# Altium schematic sheet Solar.SchDoc: OS-Solar
size A3; CompanyName: Kaasa5; DrawnBy: Nathan Kuchel; Organization: Kaasa5; Revision: 1.0.0; SheetNumber: 2; SheetTotal: 3; SheetTitle: Solar
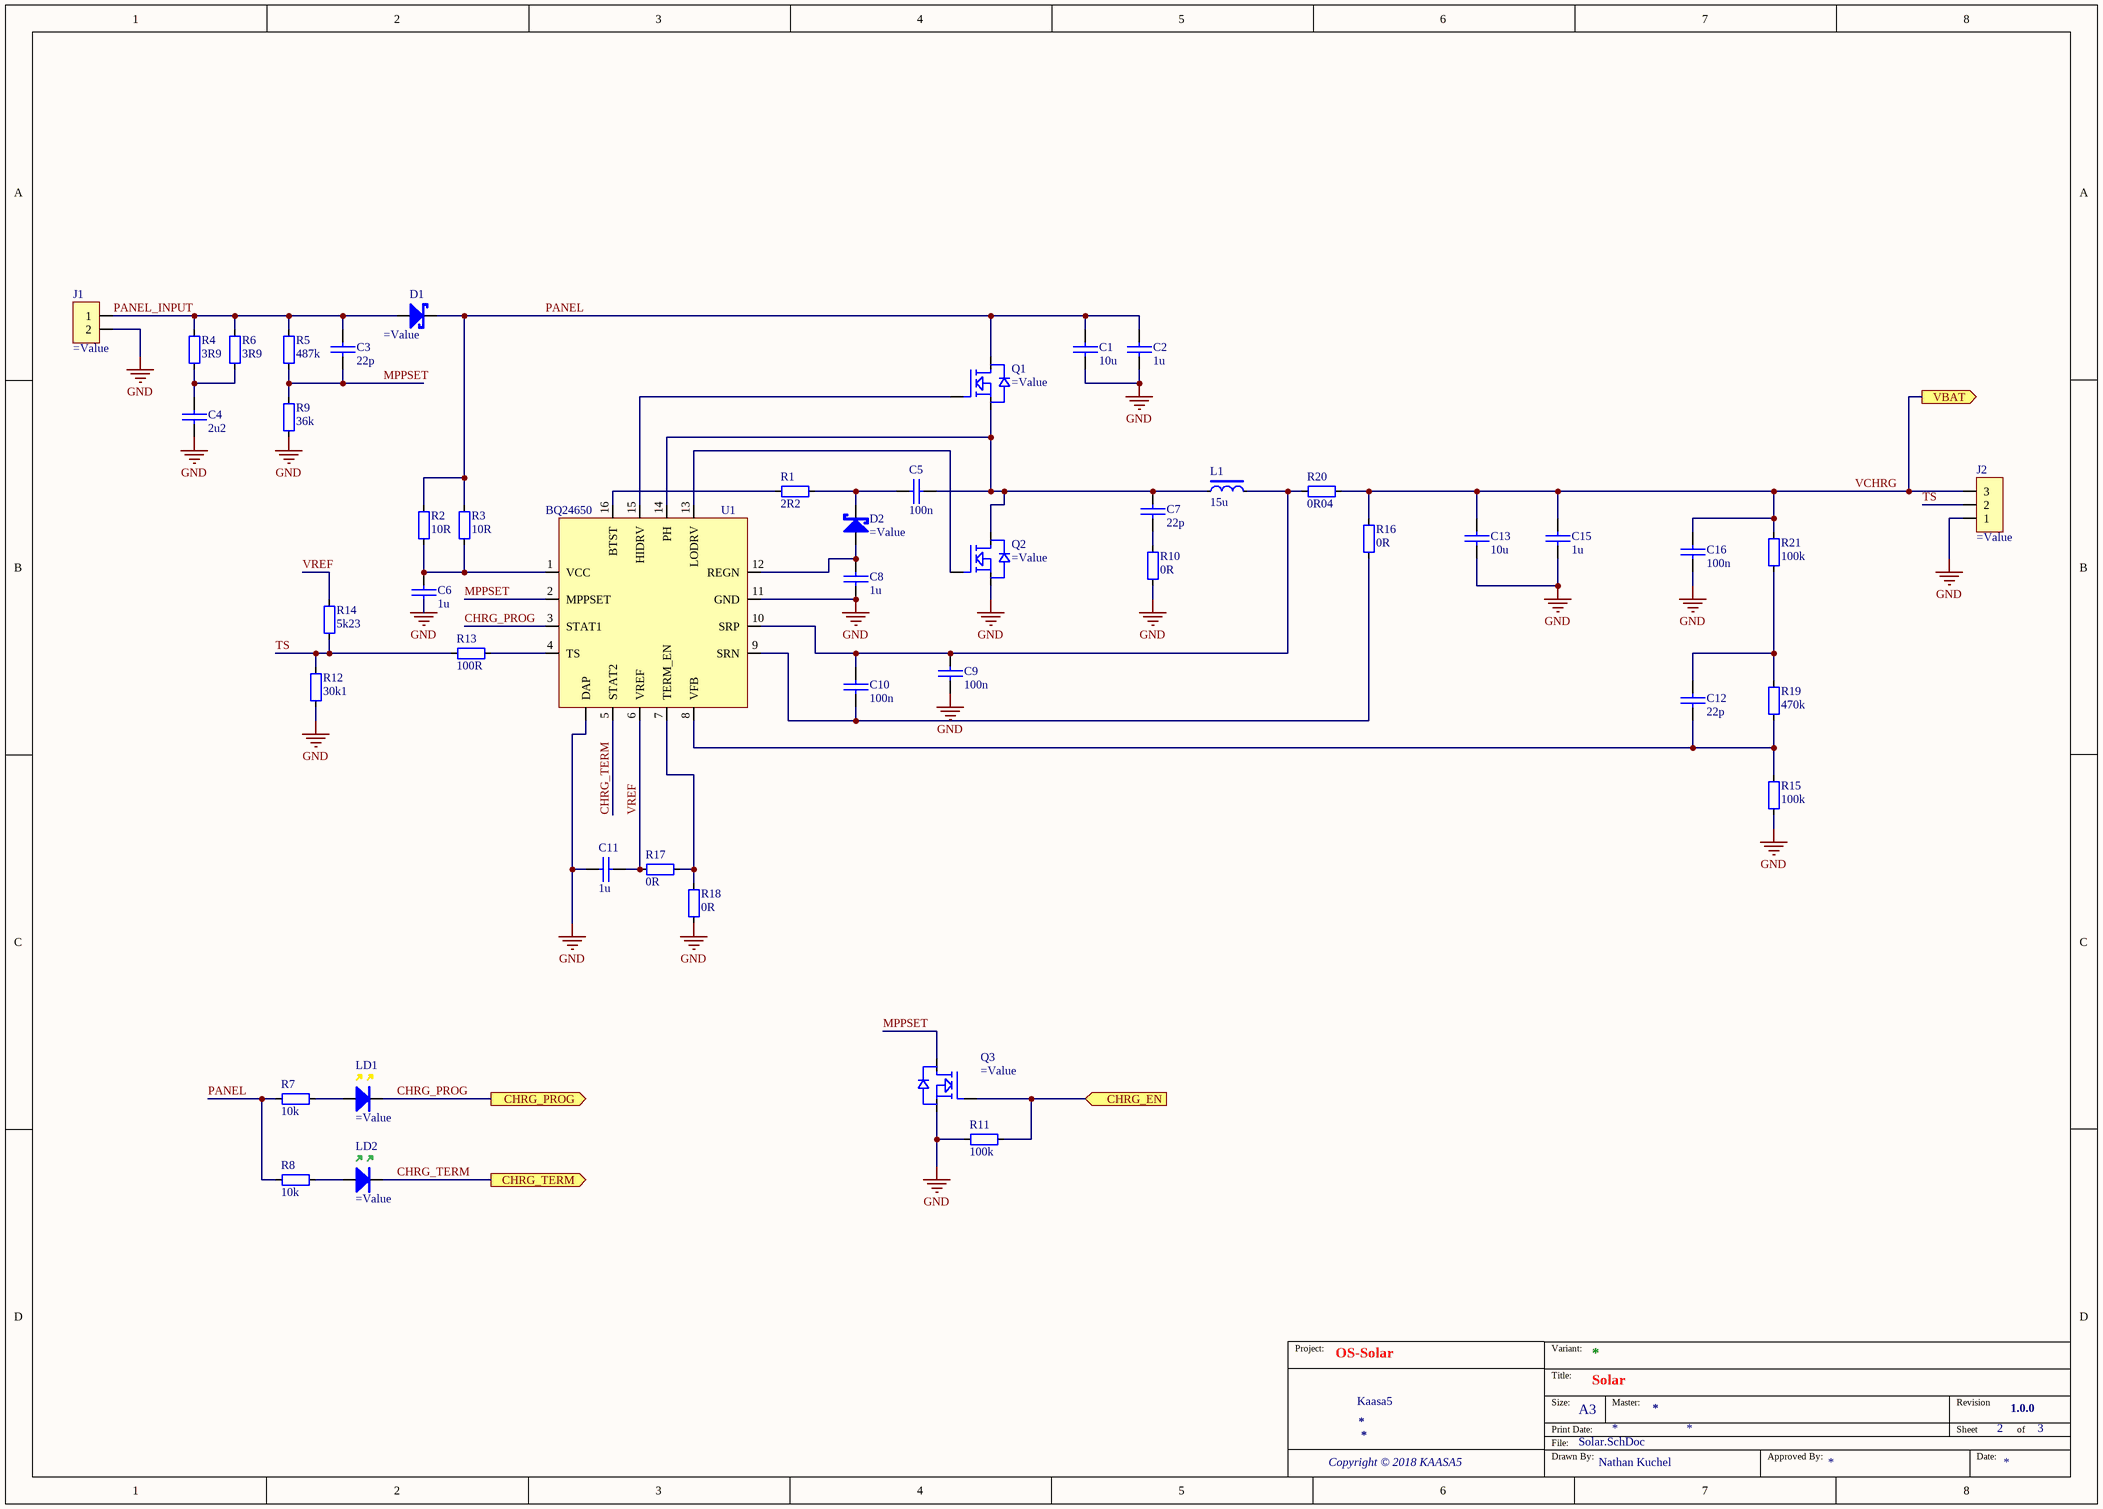
[diagram p0: Solar.SchDoc]

## Parts
C1  10u  [CAPC3216X18N]
C2  1u  [CAPC1608X09N]
C3  22p  [CAPC1608X09N]
C4  2u2  [CAPC2012X13N]
C5  100n  [CAPC1608X09N]
C6  1u  [CAPC1608X09N]
C7  22p  [CAPC1608X09N]
C8  1u  [CAPC1608X09N]
C9  100n  [CAPC1608X09N]
C10  100n  [CAPC1608X09N]
C11  1u  [CAPC1608X09N]
C12  22p  [CAPC1608X09N]
C13  10u  [CAPC3216X18N]
C15  1u  [CAPC1608X09N]
C16  100n  [CAPC1608X09N]
D1  (no value)  [DIOSMCX25N]
D2  (no value)  [DIOSMBX25N]
J1  (no value)  [HDR1X2_350_RA]
J2  (no value)  [HDR1X3_350_RA]
L1  15u  [INDP5050X28N]
LD1  (no value)  [LEDC1608X06N-YELLOW]
LD2  (no value)  [LEDC1608X06N-GREEN]
Q1  (no value)  [SOT95P230X110-3N]
Q2  (no value)  [SOT95P230X110-3N]
Q3  (no value)  [SOT95P230X110-3N]
R1  2R2  [RESC1608X06N]
R2  10R  [RESC1608X06N]
R3  10R  [RESC1608X06N]
R4  3R9  [RESC1608X06N]
R5  487k  [RESC1608X06N]
R6  3R9  [RESC1608X06N]
R7  10k  [RESC1608X06N]
R8  10k  [RESC1608X06N]
R9  36k  [RESC1608X06N]
R10  0R  [RESC1608X06N]
R11  100k  [RESC1608X06N]
R12  30k1  [RESC1608X06N]
R13  100R  [RESC1608X06N]
R14  5k23  [RESC1608X06N]
R15  100k  [RESC1608X06N]
R16  0R  [RESC1608X06N]
R17  0R  [RESC1608X06N]
R18  0R  [RESC1608X06N]
R19  470k  [RESC1608X06N]
R20  0R04  [RESC3216X07N]
R21  100k  [RESC1608X06N]
U1  BQ24650  [QFN50P350X350X90-16N]

## Ports
CHRG_EN (in), CHRG_PROG (out), CHRG_TERM (out), VBAT (out)

## Nets
GND: C1.2 C2.2 C4.2 C6.2 C8.2 C9.2 C11.1 C13.2 C15.2 C16.2 J1.2 J2.1 Q2.2(S) Q3.2(S) R9.1 R10.1 R11.1 R12.1 R15.1 R18.1 U1.11(GND) U1.DAP
CHRG_EN: Q3.1(G) R11.2 ; port CHRG_EN
CHRG_PROG: LD1.2(K) U1.3(STAT1) ; port CHRG_PROG
CHRG_TERM: LD2.2(K) U1.5(STAT2) ; port CHRG_TERM
MPPSET: C3.2 Q3.3(D) R5.1 R9.2 U1.2(MPPSET)
PANEL: C1.1 C2.1 D1.2(K) Q1.3(D) R2.2 R3.2 R7.1 R8.1
PANEL_INPUT: C3.1 D1.1(A) J1.1 R4.2 R5.2 R6.2
TS: J2.2 R12.2 R13.1 R14.1
VCHRG: C13.1 C15.1 C16.1 J2.3 R16.2 R20.2 R21.2 ; port VBAT
VREF: C11.2 R14.2 R17.2 U1.6(VREF)
NetC4_1: C4.1 R4.1 R6.1
NetC5_1: C5.1 D2.2(K) R1.2
NetC5_2: C5.2 C7.1 L1.1 Q1.2(S) Q2.3(D) U1.14(PH)
NetC6_1: C6.1 R2.1 R3.1 U1.1(VCC)
NetC7_2: C7.2 R10.2
NetC8_1: C8.1 D2.1(A) U1.12(REGN)
NetC9_1: C9.1 C10.1 L1.2 R20.1 U1.10(SRP)
NetC10_2: C10.2 R16.1 U1.9(SRN)
NetC12_1: C12.1 R19.2 R21.1
NetC12_2: C12.2 R15.2 R19.1 U1.8(VFB)
NetLD1_1: LD1.1(A) R7.2
NetLD2_1: LD2.1(A) R8.2
NetQ1_1: Q1.1(G) U1.15(HIDRV)
NetQ2_1: Q2.1(G) U1.13(LODRV)
NetR1_1: R1.1 U1.16(BTST)
NetR13_2: R13.2 U1.4(TS)
NetR17_1: R17.1 R18.2 U1.7(TERM_EN)

## Notes on the sheet
- Project:
- Variant:
- Title:
- File:
- Drawn By:
- Print Date:
- Size:
- A3
- Master:
- Approved By:
- Sheet
- Revision
- Date:
- of
- Copyright © 2018 KAASA5

## Library data of the parts
C1 C13 = 68: CAP SMD CER X7R 10% 50V 1206 (3216 Metric); Manufacturer: Samsung Electro-Mechanics; Part Number: CL31B106KBHNNNE; PartId: 68; Value: 10u; ComponentLink1Description: Datasheet; ComponentLink1URL: https://media.digikey.com/pdf/Data%20Sheets/Samsung%20PDFs/CL_Series_MLCC_ds.pdf; Supplier 1: DigiKey; Supplier Part Number 1: 1276-6767-1-ND; Price: 0.39; PartStatus: Standard
C2 = 69: CAP SMD CER X7R 10% 50V 0805 (2012 Metric); Manufacturer: Yageo; Part Number: CC0805KKX7R9BB105; PartId: 69; Value: 1u; ComponentLink1Description: Datasheet; ComponentLink1URL: https://www.yageo.com/upload/media/product/productsearch/datasheet/mlcc/UPY-GPHC_X7R_6.3V-to-50V_18.pdf; Supplier 1: DigiKey; Supplier Part Number 1: 311-1886-1-ND; Price: 0.277; PartStatus: Standard
C3 C7 C12 = 79: CAP SMD CER C0G/NPO 5% 50V 0603 (1608 Metric); Manufacturer: Yageo; Part Number: CC0603JRNPO9BN220; PartId: 79; Value: 22p; ComponentLink1Description: Datasheet; ComponentLink1URL: https://www.yageo.com/upload/media/product/productsearch/datasheet/mlcc/UPY-GP_NP0_16V-to-50V_18.pdf; Supplier 1: DigiKey; Supplier Part Number 1: 311-1062-1-ND; Price: 0.037; PartStatus: Standard
C4 = 67: CAP SMD CER X7R 10% 35V 0805 (2012 Metric); Manufacturer: Taiyo Yuden; Part Number: UMK212BB7225KG-T; PartId: 67; Value: 2u2; ComponentLink1Description: Datasheet; ComponentLink1URL: https://ds.yuden.co.jp/TYCOMPAS/ut/specSheet?pn=UMK212BB7225KG-T++; Supplier 1: DigiKey; Supplier Part Number 1: 587-3169-1-ND; Price: 0.381; PartStatus: Standard
C5 C9 C10 C16 = 65: CAP SMD CER X7R 10% 50V 0603 (1608 Metric); Manufacturer: Yageo; Part Number: CC0603KRX7R9BB104; PartId: 65; Value: 100n; ComponentLink1Description: Datasheet; ComponentLink1URL: https://www.yageo.com/upload/media/product/productsearch/datasheet/mlcc/UPY-GPHC_X7R_6.3V-to-50V_18.pdf; Supplier 1: DigiKey; Supplier Part Number 1: 311-1344-1-ND; Price: 0.0524; PartStatus: Standard
C6 C8 C11 C15 = 66: CAP SMD CER X7R 10% 25V 0603 (1608 Metric); Manufacturer: Yageo; Part Number: CC0603KRX7R8BB105; PartId: 66; Value: 1u; ComponentLink1Description: Datasheet; ComponentLink1URL: https://www.yageo.com/upload/media/product/productsearch/datasheet/mlcc/UPY-GPHC_X7R_6.3V-to-50V_18.pdf; Supplier 1: DigiKey; Supplier Part Number 1: 311-1802-1-ND; Price: 0.285; PartStatus: Standard
D1 = 58: DIODE SMD SCHOTTKY 40V 3A SMC; Manufacturer: ON Semiconductor; Value: MBRS340T3G; PartId: 58; Part Number: MBRS340T3G; ComponentLink1Description: Datasheet; ComponentLink1URL: https://www.onsemi.com/pub/Collateral/MBRS340T3-D.PDF; Supplier 1: DigiKey; Supplier Part Number 1: MBRS340T3GOSCT-ND; Price: 0.68; PartStatus: Standard
D2 = 59: DIODE SMD SCHOTTKY 40V 2A SMB; Manufacturer: ON Semiconductor; Value: MBRS240LT3G; PartId: 59; Part Number: MBRS240LT3G; ComponentLink1Description: Datasheet; ComponentLink1URL: https://www.onsemi.com/pub/Collateral/MBRS240LT3-D.PDF; Supplier 1: DigiKey; Supplier Part Number 1: MBRS240LT3GOSCT-ND; Price: 0.4; PartStatus: Standard
J1 = 107: CON THRU RIGHT ANGLE 8A 300V Header 1x2pin; Manufacturer: Molex, LLC; Value: 0395021002; PartId: 107; Part Number: 0395021002; ComponentLink1Description: Datasheet; ComponentLink1URL: https://www.molex.com/pdm_docs/sd/395021002_sd.pdf; Supplier 1: DigiKey; Supplier Part Number 1: WM7770-ND; Price: 0.84; PartStatus: Standard
J2 = 108: CON THRU RIGHT ANGLE 8A 300V Header 1x3pin; Manufacturer: Molex, LLC; Value: 0395021003; PartId: 108; Part Number: 0395021003; ComponentLink1Description: Datasheet; ComponentLink1URL: https://www.molex.com/pdm_docs/sd/395021002_sd.pdf; Supplier 1: DigiKey; Supplier Part Number 1: WM7771-ND; Price: 1.13; PartStatus: Standard
L1 = 120: IND SMD Shielded W/W 20% 1.37A 100mOhm 5028; Manufacturer: Bourns Inc.; Part Number: SRR5028-150Y; PartId: 120; Value: 15u; ComponentLink1Description: Datasheet; ComponentLink1URL: https://www.bourns.com/docs/Product-Datasheets/SRR5028.pdf; Supplier 1: DigiKey; Supplier Part Number 1: 118-SRR5028-150YCT-ND; Price: 1.1; PartStatus: Standard; Supplier 2: Mouser; Supplier Part Number 2: 652-SRR5028-150Y
LD1 = 103: LED SMD YELLOW 180mcd Max 0603 (1608 Metric); Manufacturer: Lite-On Inc.; Value: LTST-C191KSKT; PartId: 103; Part Number: LTST-C191KSKT; ComponentLink1Description: Datasheet; ComponentLink1URL: https://optoelectronics.liteon.com/upload/download/DS22-2000-224/LTST-C191KSKT.PDF; Supplier 1: DigiKey; Supplier Part Number 1: 160-1448-1-ND; Price: 0.295; PartStatus: Standard
LD2 = 104: LED SMD GREEN 71mcd Max 0603 (1608 Metric); Manufacturer: Lite-On Inc.; Value: LTST-C191KGKT; PartId: 104; Part Number: LTST-C191KGKT; ComponentLink1Description: Datasheet; ComponentLink1URL: https://optoelectronics.liteon.com/upload/download/DS22-2000-228/LTST-C191KGKT.PDF; Supplier 1: DigiKey; Supplier Part Number 1: 160-1446-1-ND; Price: 0.278; PartStatus: Standard
Q1 Q2 = 51: TRANS MOSFET N-Channel 30V 5.6A 32mOhm SOT23; Manufacturer: Diodes Incorporated; Value: DMN3042L-7; PartId: 51; Part Number: DMN3042L-7; ComponentLink1Description: Datasheet; ComponentLink1URL: https://www.diodes.com/assets/Datasheets/DMN3042L.pdf; Supplier 1: DigiKey; Supplier Part Number 1: DMN3042L-7DICT-ND; Price: 0.6; PartStatus: Standard
Q3 = 27: TRANS MOSFET N-Channel 60V 360mA SOT23; Manufacturer: Nexperia USA Inc.; Value: 2N7002P,235; PartId: 27; Part Number: 2N7002P,235; ComponentLink1Description: Datasheet; ComponentLink1URL: https://assets.nexperia.com/documents/data-sheet/2N7002P.pdf; Supplier 1: DigiKey; Supplier Part Number 1: 1727-1865-1-ND; Price: 0.244; PartStatus: Standard
R1 = 71: RES SMD Think Film 1% 1/10W 150V 0603 (1608 Metric); Manufacturer: Yageo; Part Number: RC0603FR-072R2L; PartId: 71; Value: 2R2; ComponentLink1Description: Datasheet; ComponentLink1URL: https://www.yageo.com/upload/media/product/productsearch/datasheet/rchip/PYu-RC_Group_51_RoHS_L_11.pdf; Supplier 1: DigiKey; Supplier Part Number 1: 311-2.2HRCT-ND; Price: 0.0264; PartStatus: Standard
R2 R3 = 64: RES SMD Think Film 1% 1/10W 150V 0603 (1608 Metric); Manufacturer: Yageo; Part Number: RC0603FR-0710RL; PartId: 64; Value: 10R; ComponentLink1Description: Datasheet; ComponentLink1URL: https://www.yageo.com/upload/media/product/productsearch/datasheet/rchip/PYu-RC_Group_51_RoHS_L_11.pdf; Supplier 1: DigiKey; Supplier Part Number 1: 311-10.0HRCT-ND; Price: 0.0264; PartStatus: Standard
R4 R6 = 63: RES SMD Think Film 1% 1/10W 150V 0603 (1608 Metric); Manufacturer: Yageo; Part Number: RC0603FR-073R9L; PartId: 63; Value: 3R9; ComponentLink1Description: Datasheet; ComponentLink1URL: https://www.yageo.com/upload/media/product/productsearch/datasheet/rchip/PYu-RC_Group_51_RoHS_L_11.pdf; Supplier 1: DigiKey; Supplier Part Number 1: 13-RC0603FR-073R9LCT-ND; Price: 0.0034; PartStatus: Standard
R5 = 83: RES SMD Think Film 1% 1/10W 150V 0603 (1608 Metric); Manufacturer: Yageo; Part Number: RC0603FR-07487KL; PartId: 83; Value: 487k; ComponentLink1Description: Datasheet; ComponentLink1URL: https://www.yageo.com/upload/media/product/productsearch/datasheet/rchip/PYu-RC_Group_51_RoHS_L_11.pdf; Supplier 1: DigiKey; Supplier Part Number 1: 311-487KHRCT-ND; Price: 0.0131; PartStatus: Standard
R7 R8 = 97: RES SMD Think Film 1% 1/10W 150V 0603 (1608 Metric); Manufacturer: Yageo; Part Number: RC0603FR-0710KL; PartId: 97; Value: 10k; ComponentLink1Description: Datasheet; ComponentLink1URL: https://www.yageo.com/upload/media/product/productsearch/datasheet/rchip/PYu-RC_Group_51_RoHS_L_11.pdf; Supplier 1: DigiKey; Supplier Part Number 1: 311-10.0KHRCT-ND; Price: 0.013; PartStatus: Standard
R9 = 84: RES SMD Think Film 1% 1/10W 150V 0603 (1608 Metric); Manufacturer: Yageo; Part Number: RC0603FR-0736KL; PartId: 84; Value: 36k; ComponentLink1Description: Datasheet; ComponentLink1URL: https://www.yageo.com/upload/media/product/productsearch/datasheet/rchip/PYu-RC_Group_51_RoHS_L_11.pdf; Supplier 1: DigiKey; Supplier Part Number 1: 311-36.0KHRCT-ND; Price: 0.0131; PartStatus: Standard
R10 R16-R18 = 72: RES SMD Think Film 1% 1/10W 1A 0603 (1608 Metric); Manufacturer: Yageo; Part Number: RC0603FR-070RL; PartId: 72; Value: 0R; ComponentLink1Description: Datasheet; ComponentLink1URL: https://www.yageo.com/upload/media/product/productsearch/datasheet/rchip/PYu-RC_Group_51_RoHS_L_11.pdf; Supplier 1: DigiKey; Supplier Part Number 1: 311-0.0HRCT-ND; Price: 0.0118; PartStatus: Standard
R11 R15 R21 = 73: RES SMD Think Film 1% 1/10W 150V 0603 (1608 Metric); Manufacturer: Yageo; Part Number: RC0603FR-07100KL; PartId: 73; Value: 100k; ComponentLink1Description: Datasheet; ComponentLink1URL: https://www.yageo.com/upload/media/product/productsearch/datasheet/rchip/PYu-RC_Group_51_RoHS_L_11.pdf; Supplier 1: DigiKey; Supplier Part Number 1: 311-100KHRCT-ND; Price: 0.0131; PartStatus: Standard
R12 = 82: RES SMD Think Film 1% 1/10W 150V 0603 (1608 Metric); Manufacturer: Yageo; Part Number: RC0603FR-0730K1L; PartId: 82; Value: 30k1; ComponentLink1Description: Datasheet; ComponentLink1URL: https://www.yageo.com/upload/media/product/productsearch/datasheet/rchip/PYu-RC_Group_51_RoHS_L_11.pdf; Supplier 1: DigiKey; Supplier Part Number 1: 311-30.1KHRCT-ND; Price: 0.0131; PartStatus: Standard
R13 = 80: RES SMD Think Film 1% 1/10W 150V 0603 (1608 Metric); Manufacturer: Yageo; Part Number: RC0603FR-07100RL; PartId: 80; Value: 100R; ComponentLink1Description: Datasheet; ComponentLink1URL: https://www.yageo.com/upload/media/product/productsearch/datasheet/rchip/PYu-RC_Group_51_RoHS_L_11.pdf; Supplier 1: DigiKey; Supplier Part Number 1: 311-100HRCT-ND; Price: 0.0131; PartStatus: Standard
R14 = 81: RES SMD Think Film 1% 1/10W 150V 0603 (1608 Metric); Manufacturer: Yageo; Part Number: RC0603FR-075K23L; PartId: 81; Value: 5k23; ComponentLink1Description: Datasheet; ComponentLink1URL: https://www.yageo.com/upload/media/product/productsearch/datasheet/rchip/PYu-RC_Group_51_RoHS_L_11.pdf; Supplier 1: DigiKey; Supplier Part Number 1: 311-5.23KHRCT-ND; Price: 0.0131; PartStatus: Standard
R19 = 74: RES SMD Think Film 1% 1/10W 150V 0603 (1608 Metric); Manufacturer: Yageo; Part Number: RC0603FR-07470KL; PartId: 74; Value: 470k; ComponentLink1Description: Datasheet; ComponentLink1URL: https://www.yageo.com/upload/media/product/productsearch/datasheet/rchip/PYu-RC_Group_51_RoHS_L_11.pdf; Supplier 1: DigiKey; Supplier Part Number 1: 311-470KHRCT-ND; Price: 0.0131; PartStatus: Standard
R20 = 76: RES SMD Metal Strip 1% 1/2W 35ppm 1206 (3216 Metric); Manufacturer: Vishay Dale; Part Number: WSK1206R0400FEA18; PartId: 76; Value: 0R04; ComponentLink1Description: Datasheet; ComponentLink1URL: https://www.vishay.com/docs/30325/wsk120618.pdf; Supplier 1: DigiKey; Supplier Part Number 1: 541-2752-1-ND; Price: 1.3; PartStatus: Standard
U1 = 56: IC SMD SYNC SW-MODE BAT CHRGR MPPT 28V 600kHz QFN16; Manufacturer: Texas Instruments; Value: BQ24650RVAR; PartId: 56; Part Number: BQ24650RVAR; ComponentLink1Description: Datasheet; ComponentLink1URL: https://www.ti.com/lit/ds/symlink/bq24650.pdf?HQS=TI-null-null-digikeymode-df-pf-null-wwe&ts=1596968988143; Supplier 1: DigiKey; Supplier Part Number 1: 296-46287-1-ND; Price: 6.78; PartStatus: Standard